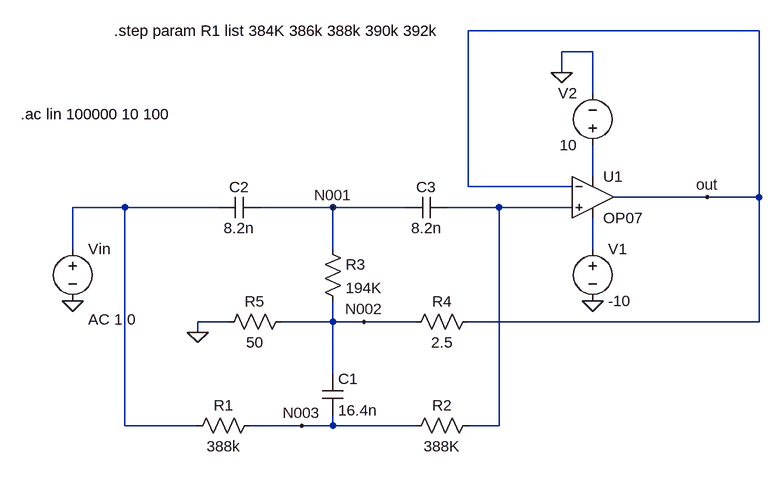
[diagram p0: schematic Phase1.asc]
Phase1.asc, the LTspice schematic file:
Version 4
SHEET 1 880 680
WIRE 848 -208 400 -208
WIRE 592 -176 544 -176
WIRE 544 -144 544 -176
WIRE 592 -112 592 -176
WIRE 592 16 592 -32
WIRE 400 32 400 -208
WIRE 560 32 400 32
WIRE 768 48 624 48
WIRE 848 48 848 -208
WIRE 848 48 768 48
WIRE -128 64 -208 64
WIRE 16 64 -128 64
WIRE 192 64 80 64
WIRE 304 64 192 64
WIRE 448 64 368 64
WIRE 560 64 448 64
WIRE -208 128 -208 64
WIRE 192 128 192 64
WIRE 592 128 592 80
WIRE 32 240 -16 240
WIRE 192 240 192 208
WIRE 192 240 112 240
WIRE 240 240 192 240
WIRE 320 240 240 240
WIRE 848 240 848 48
WIRE 848 240 400 240
WIRE -16 256 -16 240
WIRE 192 320 192 240
WIRE -128 400 -128 64
WIRE -16 400 -128 400
WIRE 144 400 64 400
WIRE 192 400 192 384
WIRE 192 400 144 400
WIRE 320 400 192 400
WIRE 448 400 448 64
WIRE 448 400 400 400
FLAG -208 208 0
FLAG -16 256 0
FLAG 592 208 0
FLAG 544 -144 0
FLAG 768 48 out
FLAG 192 64 N001
FLAG 240 240 N002
FLAG 144 400 N003
SYMBOL cap 80 48 R90
WINDOW 0 0 32 VBottom 2
WINDOW 3 32 32 VTop 2
SYMATTR InstName C2
SYMATTR Value 8.2n
SYMBOL cap 368 48 R90
WINDOW 0 0 32 VBottom 2
WINDOW 3 32 32 VTop 2
SYMATTR InstName C3
SYMATTR Value 8.2n
SYMBOL res 176 112 R0
SYMATTR InstName R3
SYMATTR Value 194K
SYMBOL res 80 384 R90
WINDOW 0 0 56 VBottom 2
WINDOW 3 32 56 VTop 2
SYMATTR InstName R1
SYMATTR Value 388k
SYMBOL res 416 384 R90
WINDOW 0 0 56 VBottom 2
WINDOW 3 32 56 VTop 2
SYMATTR InstName R2
SYMATTR Value 388K
SYMBOL cap 176 320 R0
SYMATTR InstName C1
SYMATTR Value 16.4n
SYMBOL res 416 224 R90
WINDOW 0 0 56 VBottom 2
WINDOW 3 32 56 VTop 2
SYMATTR InstName R4
SYMATTR Value 2.5
SYMBOL res 128 224 R90
WINDOW 0 0 56 VBottom 2
WINDOW 3 32 56 VTop 2
SYMATTR InstName R5
SYMATTR Value 50
SYMBOL voltage -208 112 R0
WINDOW 3 24 152 Left 2
WINDOW 123 24 124 Left 2
WINDOW 39 0 0 Left 0
SYMATTR Value ""
SYMATTR Value2 AC 1 0
SYMATTR InstName Vin
SYMBOL voltage 592 112 R0
WINDOW 123 0 0 Left 0
WINDOW 39 0 0 Left 0
SYMATTR InstName V1
SYMATTR Value -10
SYMBOL voltage 592 -16 R180
WINDOW 0 24 96 Left 2
WINDOW 3 24 16 Left 2
WINDOW 123 0 0 Left 0
WINDOW 39 0 0 Left 0
SYMATTR InstName V2
SYMATTR Value 10
SYMBOL OP07 592 -16 R0
SYMATTR InstName U1
TEXT -288 -80 Left 2 !.ac lin 100000 10 100
TEXT -144 -208 Left 2 !.step param R1 list 384K 386k 388k 390k 392k

The netlist it stands for:
* Phase1.asc
C2 N001 N005 8.2n
C3 N006 N001 8.2n
R3 N001 N002 194K
R1 N003 N005 388k
R2 N006 N003 388K
C1 N002 N003 16.4n
R4 out N002 2.5
R5 N002 0 50
Vin N005 0 AC 1 0
V1 N007 0 -10
V2 N004 0 10
XU1 N006 out N004 N007 out LT1001  ; OP07, pins In+ In- V+ V- OUT
.ac lin 100000 10 100
.step param R1 list 384K 386k 388k 390k 392k
.lib LTC.lib
.backanno
.end